# Altium schematic sheet 1 - Connectors.SchDoc: Connectors
size Letter; DrawnBy: Adrianna Ascalon; Organization: UW Robotics; Address1: 200 University Avenue; Address2: Waterloo; Address3: Ontario; Address4: Canada N2L 3G6; SheetNumber: 2; SheetTotal: 3
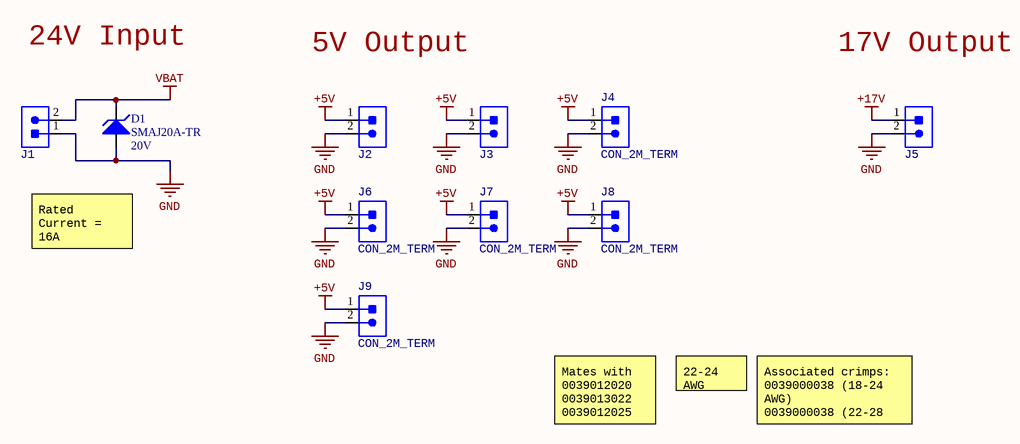
[diagram p0: 1 - Connectors.SchDoc]

## Parts
D1  Reverse Standoff Voltage: 20V  [DO-214AC_UNI]  (hidden comment: SMAJ20A-TR)
J1  CON_2M_TERM  [1935161]  (value not drawn)
J2  CON_2M_TERM  [1935161]  (value not drawn)
J3  CON_2M_TERM  [1935161]  (value not drawn)
J4  CON_2M_TERM  [1935161]
J5  CON_2M_TERM  [1935161]  (value not drawn)
J6  CON_2M_TERM  [1935161]
J7  CON_2M_TERM  [1935161]
J8  CON_2M_TERM  [1935161]
J9  CON_2M_TERM  [1935161]

## Nets
+5V: J2.1 J3.1 J4.1 J6.1 J7.1 J8.1 J9.1
+17V: J5.1
GND: D1.1 J1.1 J2.2 J3.2 J4.2 J5.2 J6.2 J7.2 J8.2 J9.2
VBAT: D1.2 J1.2

## Notes on the sheet
- 24V Input
- 5V Output
- 17V Output
- Rated Current = 16A
- Mates with 0039012020 0039013022
  0039012025
- 22-24 AWG
- Associated crimps:
  0039000038 (18-24 AWG)
  0039000038 (22-28 AWG)
  0039000077 (16 AWG)
- Title
- Size:
- Date:
- Letter
- Drawn By:
- Sheet
- of
- File:

## Library data of the parts
D1 = SMAJ20A-TR: TVS DIODE, 400W, 20V, DO-214AC (SMA); Manufacturer 1: STMicroelectronics; Min Breakdown Voltage: 22.2V; Clamping Voltage: 42.8V; Peak Pulse Current: 54A; Test Current: 1mA; Element Configuration: Single; Max Reverse Leakage Current: 200nA; Direction: Unidirectional; Number of Unidirectional Channels: 1; Power Line Protection: No; Max Breakdown Voltage: 23.4V; Supplier 1: Digi-Key; RoHS: Yes; Category: TVS Diodes; Stock 1: 8295; Pricing 1: 1=0.36000, 10=0.29500, 25=0.26960, 100=0.16930, 250=0.16740, 500=0.15676, 1000=0.10659, 2500=0.10220 (USD); Mount: Surface Mount; Case/Package: SMA; Number of Pins: 2; Min Operating Temperature: -55°C; Max Operating Temperature: 150°C; Peak Pulse Power: 400W; Packaging: Tape and Reel; Composition: Zener; Leakage Current: 200nA; Breakdown Voltage: 22.2V; Polarity: Unidirectional; Number of Elements: 1; Reverse Breakdown Voltage: 22.2V; Package Quantity: 5000; Max Power Dissipation: 400W; Power Dissipation: 400W; Lead Free: Lead Free; ComponentLink1URL: https://datasheet.ciiva.com:443/pdfs/VipMasterIC/IC/SGST/SGSTS27501/SGSTS27501-1.pdf?src-supplier=IHS+Markit; ComponentLink1Description: https://datasheet.ciiva.com:443/pdfs/VipMasterIC/IC/SGST/SGSTS27501/SGSTS27501-1.pdf?src-supplier=IHS+Markit; ComponentLink2URL: https://datasheet.ciiva.com/15063/cd00001333-15063686.pdf?src-supplier=Digi-Key; ComponentLink2Description: https://datasheet.ciiva.com/15063/cd00001333-15063686.pdf?src-supplier=Digi-Key; Supplier Part Number 1: 497-16189-1-ND; Manufacturer Part Number 1: SMAJ20A-TR
J1 = CON_2M_TERM: TERM BLK 2POS SIDE ENTRY 5MM; Manufacturer 1: Phoenix Contact; Voltage: 300V; Current: 18A; Connector Type: Screw; Voltage Rating (DC): 320V; Max Current Rating: 16A; Max Supply Voltage: 250V; Current Rating: 17.5A; Number of Poles: 2; Number of Levels: 1; Wire Gauge (Max): 26AWG; Wire Gauge (Min): 12AWG; Approvals: UL; Supplier 1: Digi-Key; Pitch: 5mm; Manufacturer Part Number 1: 1935161; Supplier Part Number 1: 277-1667-ND; Stock 1: 15494; Pricing 1: 1=0.43000, 10=0.41100, 50=0.39280, 100=0.38200, 250=0.35700, 500=0.32844, 1000=0.30350 (USD); RoHS: Yes; Mount: Through Hole; Number of Pins: 2; Weight: 0.067021oz; Contact Material: Copper,Tin; Insulation Material: Nylon; Housing Material: Polyamide; Housing Color: Green; Color: Green; Material: Nylon; Number of Rows: 1; Voltage Rating: 250V; Package Quantity: 250; Packaging: Bulk; Number of Positions: 2; Number of Positions Per Level: 2; Termination: Solder; Number of Contacts: 2; Number of Circuits: 2; Orientation: Straight; Length: 9mm; Height: 11.3mm; Width: 14.9mm; Depth: 9mm; Wire/Cable Gauge: 26AWG; Radiation Hardening: No; Flammability Rating: UL94 V-0; Lead Free: Lead Free; REACH SVHC: Unknown; ComponentLink1URL: https://datasheet.ciiva.com/15169/getdatasheetpartid-177903-15169663.pdf?src-supplier=Verical; ComponentLink1Description: https://datasheet.ciiva.com/15169/getdatasheetpartid-177903-15169663.pdf?src-supplier=Verical; ComponentLink2URL: https://datasheet.ciiva.com/16047/1935161-16047247.pdf?src-supplier=Onlinecomponents.com; ComponentLink2Description: https://datasheet.ciiva.com/16047/1935161-16047247.pdf?src-supplier=Onlinecomponents.com; ComponentLink3URL: https://datasheet.ciiva.com/824/combiconcompact5-0mmseries-824222.pdf?src-supplier=Digi-Key; ComponentLink3Description: https://datasheet.ciiva.com/824/combiconcompact5-0mmseries-824222.pdf?src-supplier=Digi-Key
J2-J9 = CON_2M_TERM: TERM BLK 2POS SIDE ENTRY 5MM; Manufacturer 1: Phoenix Contact; Number of Contacts: 2; Connector Type: Screw; Voltage Rating (DC): 320V; Max Current Rating: 16A; Max Supply Voltage: 250V; Current Rating: 17.5A; Number of Levels: 1; Current: 18A; Voltage: 300V; Wire Gauge (Max): 26AWG; Wire Gauge (Min): 12AWG; Approvals: UL; Supplier 1: Digi-Key; Stock 1: 15494; Pricing 1: 1=0.43000, 10=0.41100, 50=0.39280, 100=0.38200, 250=0.35700, 500=0.32844, 1000=0.30350 (USD); RoHS: Yes; Mount: Through Hole; Contact Material: Copper,Tin; Housing Material: Polyamide; Color: Green; Packaging: Bulk; Number of Rows: 1; Orientation: Straight; Number of Positions: 2; Termination: Solder; Length: 9mm; Pitch: 5mm; Depth: 9mm; ComponentLink1URL: https://datasheet.ciiva.com/15169/getdatasheetpartid-177903-15169663.pdf?src-supplier=Verical; ComponentLink1Description: https://datasheet.ciiva.com/15169/getdatasheetpartid-177903-15169663.pdf?src-supplier=Verical; ComponentLink2URL: https://datasheet.ciiva.com/16047/1935161-16047247.pdf?src-supplier=Onlinecomponents.com; ComponentLink2Description: https://datasheet.ciiva.com/16047/1935161-16047247.pdf?src-supplier=Onlinecomponents.com; ComponentLink3URL: https://datasheet.ciiva.com/824/combiconcompact5-0mmseries-824222.pdf?src-supplier=Digi-Key; ComponentLink3Description: https://datasheet.ciiva.com/824/combiconcompact5-0mmseries-824222.pdf?src-supplier=Digi-Key; Supplier Part Number 1: 277-1667-ND; Manufacturer Part Number 1: 1935161; Number of Pins: 2; Weight: 0.067021oz; Insulation Material: Nylon; Housing Color: Green; Material: Nylon; Voltage Rating: 250V; Package Quantity: 250; Number of Poles: 2; Number of Positions Per Level: 2; Number of Circuits: 2; Height: 11.3mm; Width: 14.9mm; Wire/Cable Gauge: 26AWG; Radiation Hardening: No; Flammability Rating: UL94 V-0; Lead Free: Lead Free; REACH SVHC: Unknown